# Altium schematic sheet DSD_SDR_MainBoard_Quad.SchDoc
size A4; SheetNumber: 1; SheetTotal: 2
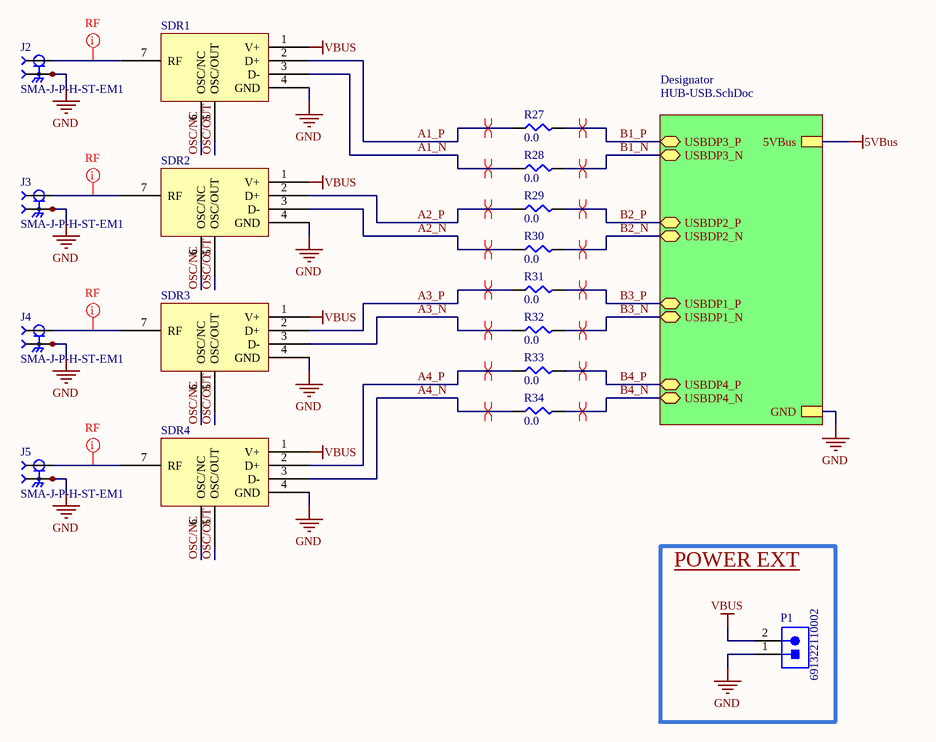
[diagram p0: DSD_SDR_MainBoard_Quad.SchDoc]

## Parts
J2  SMA-J-P-H-ST-EM1  [SAMTEC_SMA-J-P-H-ST-EM1]
J3  SMA-J-P-H-ST-EM1  [SAMTEC_SMA-J-P-H-ST-EM1]
J4  SMA-J-P-H-ST-EM1  [SAMTEC_SMA-J-P-H-ST-EM1]
J5  SMA-J-P-H-ST-EM1  [SAMTEC_SMA-J-P-H-ST-EM1]
P1  691322110002  [691322110002]
R27  0.0  [SMD-0603-RES]
R28  0.0  [SMD-0603-RES]
R29  0.0  [SMD-0603-RES]
R30  0.0  [SMD-0603-RES]
R31  0.0  [SMD-0603-RES]
R32  0.0  [SMD-0603-RES]
R33  0.0  [SMD-0603-RES]
R34  0.0  [SMD-0603-RES]
SDR1  SDR_Module  [SDR]  (value not drawn)
SDR2  SDR_Module  [SDR]  (value not drawn)
SDR3  SDR_Module  [SDR]  (value not drawn)
SDR4  SDR_Module  [SDR]  (value not drawn)

## Blocks framed on the sheet
POWER EXT: P1

## Sub-sheets
Designator = HUB-USB.SchDoc: USBDP1_N (bidir), USBDP1_P (bidir), USBDP2_N (bidir), USBDP2_P (bidir), USBDP3_N (bidir), USBDP3_P (bidir), USBDP4_N (bidir), USBDP4_P (bidir), GND, 5VBus

## Nets
5VBus: sheet Designator/5VBus
GND: J2.2_1 J2.2_2 J2.3_1 J2.3_2 J3.2_1 J3.2_2 J3.3_1 J3.3_2 J4.2_1 J4.2_2 J4.3_1 J4.3_2 J5.2_1 J5.2_2 J5.3_1 J5.3_2 P1.1 SDR1.4(GND) SDR2.4(GND) SDR3.4(GND) SDR4.4(GND) ; sheet Designator/GND
VBUS: P1.2 SDR1.1(V+) SDR2.1(V+) SDR3.1(V+) SDR4.1(V+)
A1_N: R28.1 SDR1.3(D-)
A1_P: R27.1 SDR1.2(D+)
A2_N: R30.1 SDR2.3(D-)
A2_P: R29.1 SDR2.2(D+)
A3_N: R32.1 SDR3.3(D-)
A3_P: R31.1 SDR3.2(D+)
A4_N: R34.1 SDR4.3(D-)
A4_P: R33.1 SDR4.2(D+)
B1_N: R28.2 ; sheet Designator/USBDP3_N
B1_P: R27.2 ; sheet Designator/USBDP3_P
B2_N: R30.2 ; sheet Designator/USBDP2_N
B2_P: R29.2 ; sheet Designator/USBDP2_P
B3_N: R32.2 ; sheet Designator/USBDP1_N
B3_P: R31.2 ; sheet Designator/USBDP1_P
B4_N: R34.2 ; sheet Designator/USBDP4_N
B4_P: R33.2 ; sheet Designator/USBDP4_P
OSC/NC: SDR1.6(OSC/NC) SDR2.6(OSC/NC) SDR3.6(OSC/NC) SDR4.6(OSC/NC)
OSC/OUT: SDR1.5(OSC/OUT) SDR2.5(OSC/OUT) SDR3.5(OSC/OUT) SDR4.5(OSC/OUT)
NetJ2_1: J2.1 SDR1.7(RF)
NetJ3_1: J3.1 SDR2.7(RF)
NetJ4_1: J4.1 SDR3.7(RF)
NetJ5_1: J5.1 SDR4.7(RF)

## Layout directives
differential pair: A1_N, A1_P, A2_N, A2_P, A3_N, A3_P, A4_N, A4_P, B1_N, B1_P, B2_N, B2_P, B3_N, B3_P, B4_N, B4_P
net class RF: NetJ2_1, NetJ3_1, NetJ4_1, NetJ5_1

## Library data of the parts
J2-J5 = SMA-J-P-H-ST-EM1: SMA Connector Jack, Female Socket 50Ohm Board Edge, End Launch Solder; MF: Samtec; Package: None; Price: None; Value: *; MP: SMA-J-P-H-ST-EM1; Availability: Unavailable
P1 = 691322110002: WR-TBL Serie 3221 Horizontal PCB Header, Pluggable, THT, pitch 3.5mm, 2p; Manufacturer: Wurth Elektronik; Modularity: No; Pin Number: 2; Rated Current [UL]: 10A; Working Voltage [UL]: 300VAC; ComponentLink1Description: Manufacturer; ComponentLink1URL: http://www.we-online.de; ComponentLink2URL: https://katalog.we-online.de/em/datasheet/691322110002.pdf; ComponentLink2Description: Datasheet; Mounting Technology: THT; Manufacturer Part Number: 691322110002; Packaging: Box; Operating Temperature: -40 to +105degC; PCB/Cable/Panel: PCB; Pitch: 3.5mm; Published Date: Feburary 2021; Type: Horizontal; Application: Pluggable
R27-R34 = ERJ-3GEY0R00V: RES SMD 0.0OHM JUMPER 1/10W 0603; Manufacturer: Panasonic Electronic Components; Factory Stock: 0; Unit Price (USD): 0.00352; @ qty: 1500; Minimum Quantity: 1; Power (Watts): 0.1W, 1/10W; Part Number: ERJ-3GEY0R00V; Datasheets: http://industrial.panasonic.com/www-cgi/jvcr13pz.cgi?E+PZ+3+AOA0001+ERJ3GEY0R00V+7+WW; Image: //media.digikey.com/Photos/Panasonic%20Photos/MFG_ERJ-P6W%20Series.jpg; Digi-Key Part Number: P0.0GCT-ND; Quantity Available: 4813372; Packaging: Cut Tape (CT); Series: ERJ; Part Status: Active; Value: 0.0; Tolerance: Jumper; Composition: Thick Film; Features: Automotive AEC-Q200; Temperature Coefficient: -; Operating Temperature: -55°C ~ 155°C; Package / Case: 0603 (1608 Metric); Supplier Device Package: 0603; Size / Dimension: 0.063" L x 0.031" W (1.60mm x 0.80mm); Height - Seated (Max): 0.022" (0.55mm); Number of Terminations: 2; Failure Rate: -